# Altium schematic sheet ESP32_BDB-2.SchDoc
size Tabloid; SheetNumber: 2; SheetTotal: 2
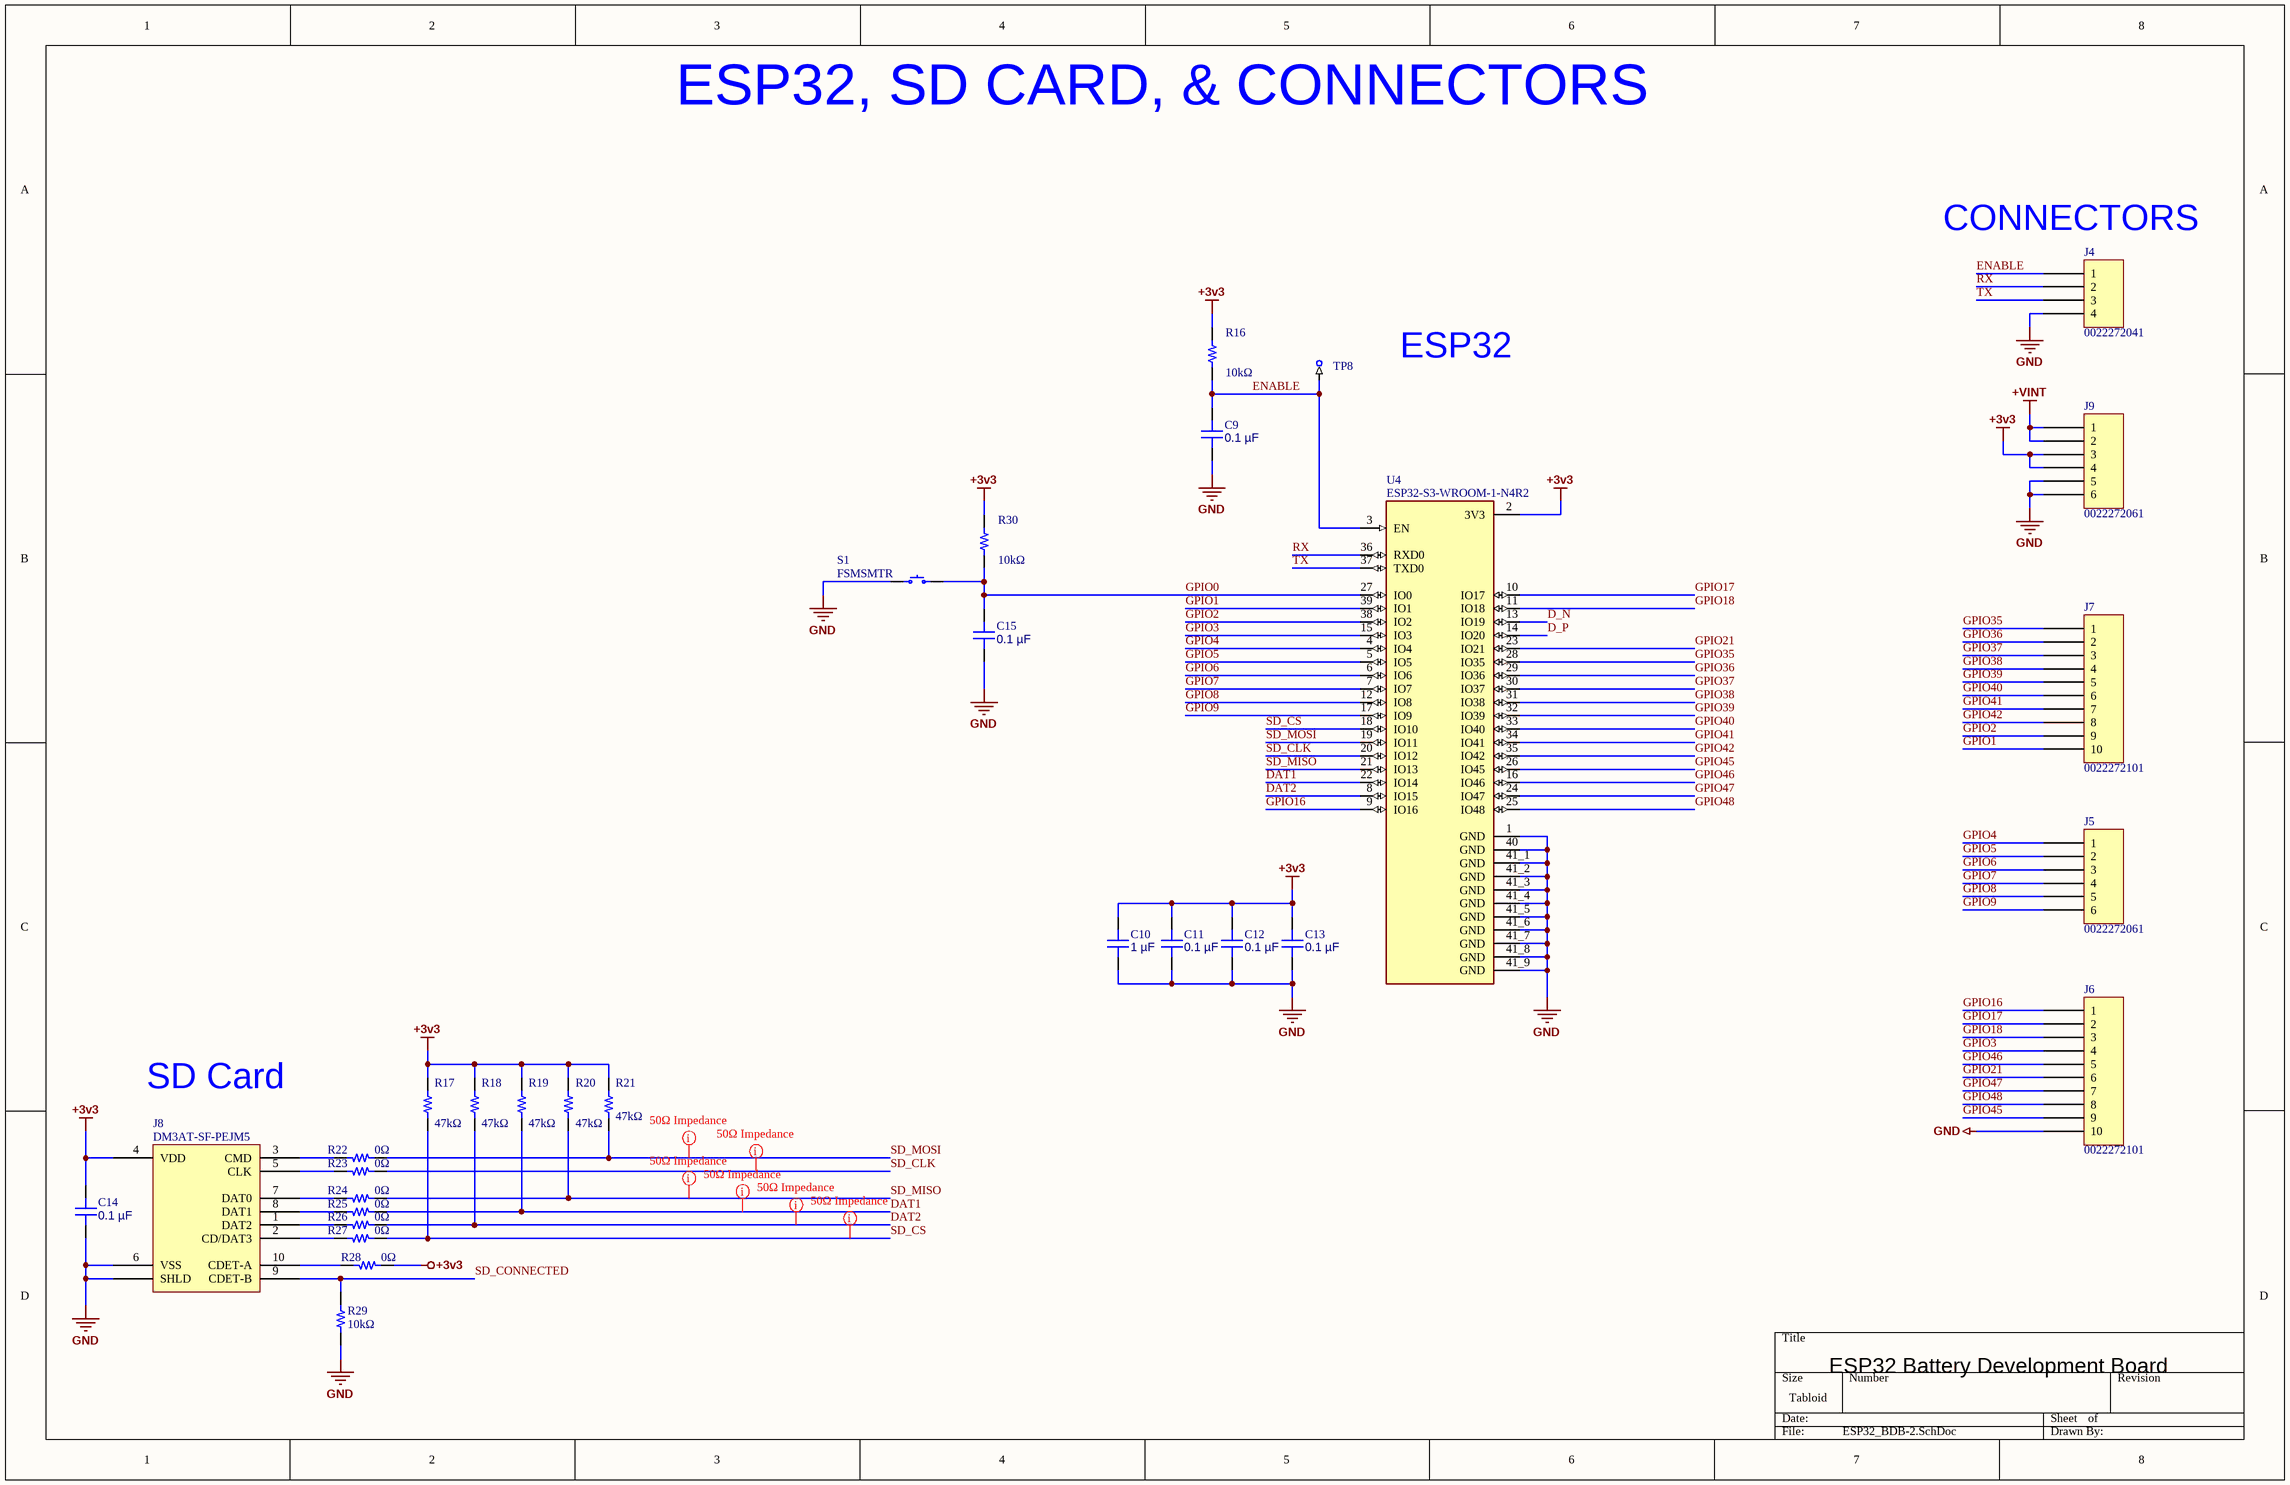
[diagram p0: ESP32_BDB-2.SchDoc]

## Parts
C9  0.1 µF  [CAP 0603_1608]
C10  1 µF  [CAP 0603_1608]
C11  0.1 µF  [CAP 0603_1608]
C12  0.1 µF  [CAP 0603_1608]
C13  0.1 µF  [CAP 0603_1608]
C14  0.1 µF  [CAP 0603_1608]
C15  0.1 µF  [CAP 0603_1608]
J4  0022272041  [MOLEX KK 0022272041]
J5  0022272061  [MOLEX KK 0022272061]
J6  0022272101  [MOLEX KK 0022272101]
J7  0022272101  [MOLEX KK 0022272101]
J8  DM3AT-SF-PEJM5  [HIROSE DM3AT-SF-PEJM5]
J9  0022272061  [MOLEX KK 0022272061]
R16  10kΩ  [RES 0603_1608]
R17  47kΩ  [RES 0603_1608]
R18  47kΩ  [RES 0603_1608]
R19  47kΩ  [RES 0603_1608]
R20  47kΩ  [RES 0603_1608]
R21  47kΩ  [RES 0603_1608]
R22  0Ω  [RES 0805_2012]
R23  0Ω  [RES 0805_2012]
R24  0Ω  [RES 0805_2012]
R25  0Ω  [RES 0805_2012]
R26  0Ω  [RES 0805_2012]
R27  0Ω  [RES 0805_2012]
R28  0Ω  [RES 0805_2012]
R29  10kΩ  [RES 0603_1608]
R30  10kΩ  [RES 0603_1608]
S1  FSMSMTR  [TE FSMSMTR]
TP8  5016  [KEYSTONE-5016_V]  (value not drawn)
U4  ESP32-S3-WROOM-1-N4R2  [XCVR_ESP32-S3-WROOM-1-N4R2]

## Nets
+3v3: C10.2 C11.2 C12.2 C13.2 C14.2 J8.4(VDD) J9.3 J9.4 R16.2 R17.2 R18.2 R19.2 R20.2 R21.2 R28.1 R30.2 U4.2(3V3)
+VINT: J9.1 J9.2
GND: C9.1 C10.1 C11.1 C12.1 C13.1 C14.1 C15.1 J4.4 J6.10 J8.6(VSS) J8.S(SHLD) J9.5 J9.6 R29.1 S1.1 U4.1(GND) U4.40(GND) U4.41_1(GND) U4.41_2(GND) U4.41_3(GND) U4.41_4(GND) U4.41_5(GND) U4.41_6(GND) U4.41_7(GND) U4.41_8(GND) U4.41_9(GND)
D_N: U4.13(IO19)
D_P: U4.14(IO20)
DAT1: R19.1 R25.1 U4.22(IO14)
DAT2: R18.1 R26.1 U4.8(IO15)
ENABLE: C9.2 J4.1 R16.1 TP8.1 U4.3(EN)
GPIO0: C15.2 R30.1 S1.2 U4.27(IO0)
GPIO1: J7.10 U4.39(IO1)
GPIO2: J7.9 U4.38(IO2)
GPIO3: J6.4 U4.15(IO3)
GPIO4: J5.1 U4.4(IO4)
GPIO5: J5.2 U4.5(IO5)
GPIO6: J5.3 U4.6(IO6)
GPIO7: J5.4 U4.7(IO7)
GPIO8: J5.5 U4.12(IO8)
GPIO9: J5.6 U4.17(IO9)
GPIO16: J6.1 U4.9(IO16)
GPIO17: J6.2 U4.10(IO17)
GPIO18: J6.3 U4.11(IO18)
GPIO21: J6.6 U4.23(IO21)
GPIO35: J7.1 U4.28(IO35)
GPIO36: J7.2 U4.29(IO36)
GPIO37: J7.3 U4.30(IO37)
GPIO38: J7.4 U4.31(IO38)
GPIO39: J7.5 U4.32(IO39)
GPIO40: J7.6 U4.33(IO40)
GPIO41: J7.7 U4.34(IO41)
GPIO42: J7.8 U4.35(IO42)
GPIO45: J6.9 U4.26(IO45)
GPIO46: J6.5 U4.16(IO46)
GPIO47: J6.7 U4.24(IO47)
GPIO48: J6.8 U4.25(IO48)
RX: J4.2 U4.36(RXD0)
SD_CLK: R23.1 U4.20(IO12)
SD_CONNECTED: J8.9(CDET-B) R29.2
SD_CS: R17.1 R27.1 U4.18(IO10)
SD_MISO: R20.1 R24.1 U4.21(IO13)
SD_MOSI: R21.1 R22.1 U4.19(IO11)
TX: J4.3 U4.37(TXD0)
NetJ8_1: J8.1(DAT2) R26.2
NetJ8_2: J8.2(CD/DAT3) R27.2
NetJ8_3: J8.3(CMD) R22.2
NetJ8_5: J8.5(CLK) R23.2
NetJ8_7: J8.7(DAT0) R24.2
NetJ8_8: J8.8(DAT1) R25.2
NetJ8_10: J8.10(CDET-A) R28.2

## Layout directives
rule Width Constraint [Pref Impedance = 50.00ohms    Min Impedance = 50.00ohms    Max Impedance = 50.00ohms]: DAT1, DAT2, SD_CLK, SD_CS, SD_MISO, SD_MOSI

## Notes on the sheet
- ESP32, SD CARD, & CONNECTORS
- (near J4) CONNECTORS
- ESP32
- SD Card
- ESP32 Battery Development Board

## Library data of the parts
C9 C11-C15 = C0603C104K5RAC7411: CAP CER 0.1UF 50V X7R 0603; manufacturer: KEMET; Tolerance: ±10%; Part Number: C0603C104K5RAC7411; Capacitance: 0.1 µF; Applications: Bypass, Decoupling; componentlink1description: Datasheet; componentlink1url: https://api.kemet.com/component-edge/download/datasheet/C0603C104K5RAC7411.pdf; componentlink2description: DigiKey Link; componentlink2url: https://www.digikey.com/en/products/detail/kemet/C0603C104K5RAC7411/3317013; Device Package: 0603 (1608 Metric); lastupdated: 2026-04-06 7:23:52 PM; Lifecycle Status: Active; Minimum Order: 1; Mounting Type: Surface Mount, MLCC; Operating Temperature: -55°C ~ 125°C; Package / Case: 0603 (1608 Metric); packaging: TapeAndReel; partid: 2233; Part Status: Active; price: 0.01; series: SMD Comm X7R; Size / Dimension: 0.063" L x 0.031" W (1.60mm x 0.80mm); Supplier 1: DigiKey; Supplier Part Number 1: 399-C0603C104K5RAC7411CT-ND; Temperature Coefficient: X7R; Thickness (Max): 0.035" (0.90mm); value: 0.1 µF; Voltage - Rated: 50V
C10 = CC0603KRX7R6BB105: CAP CER 1UF 10V X7R 0603; manufacturer: Yageo; Tolerance: ±10%; Part Number: CC0603KRX7R6BB105; Capacitance: 1 µF; Applications: General Purpose; componentlink1description: Datasheet; componentlink1url: https://www.yageo.com/upload/media/product/productsearch/datasheet/mlcc/UPY-GPHC_X7R_6.3V-to-50V_18.pdf; componentlink2description: DigiKey Link; componentlink2url: https://www.digikey.com/en/products/detail/yageo/CC0603KRX7R6BB105/5195204; Device Package: 0603 (1608 Metric); lastupdated: 2026-04-06 7:23:52 PM; Lifecycle Status: Active; Minimum Order: 1; Mounting Type: Surface Mount, MLCC; Operating Temperature: -55°C ~ 125°C; Package / Case: 0603 (1608 Metric); packaging: TapeAndReel; partid: 2290; Part Status: Active; price: 0.02; series: CC; Size / Dimension: 0.063" L x 0.031" W (1.60mm x 0.80mm); Supplier 1: DigiKey; Supplier Part Number 1: 311-1796-1-ND; Temperature Coefficient: X7R; Thickness (Max): 0.035" (0.90mm); value: 1 µF; Voltage - Rated: 10V
J4 = 0022272041: CONN HEADER VERT 4POS 2.54MM; Manufacturer: Molex; Contact Length - Mating: 0.295" (7.49mm); Contact Length - Post: 0.140" (3.56mm); Material Flammability Rating: UL94 V-0; Number of Positions: 4; Number of Positions Loaded: All; Overall Contact Length: 0.560" (14.22mm); Pitch - Mating: 0.100" (2.54mm); Shrouding: Shrouded - 1 Wall; Style: Board to Cable/Wire; Part Number: 0022272041; ComponentLink1Description: Datasheet; ComponentLink1URL: https://www.molex.com/pdm_docs/sd/022272041_sd.pdf; ComponentLink2Description: DigiKey Link; ComponentLink2URL: http://digikey.com/product-detail/en/molex/0022272041/WM4113-ND/1130579; Connector Type: Header; Contact Finish - Mating: Tin; Contact Finish - Post: Tin; Contact Finish Thickness - Mating: 100.0µin (2.54µm); Contact Material: Brass; Contact Shape: Square; Contact Type: Male Pin; Fastening Type: Friction Lock; Insulation Color: Natural; Insulation Height: 0.461" (11.70mm); Insulation Material: Polyamide (PA), Nylon; LastUpdated: 2020-01-12 11:52:05 PM; Lifecycle Status: Active; Minimum Order: 1; Mounting Type: Through Hole; Number of Rows: 1; Packaging: Bulk; PartId: 78; Part Status: Active; Price: 0.40; Series: KK 6410; Supplier 1: DigiKey; Supplier Part Number 1: WM4113-ND; Termination: Solder
J5 J9 = 0022272061: CONN HEADER VERT 6POS 2.54MM; Manufacturer: Molex; Contact Length - Mating: 0.295" (7.49mm); Contact Length - Post: 0.140" (3.56mm); Material Flammability Rating: UL94 V-0; Number of Positions: 6; Number of Positions Loaded: All; Overall Contact Length: 0.560" (14.22mm); Pitch - Mating: 0.100" (2.54mm); Shrouding: Shrouded - 1 Wall; Style: Board to Cable/Wire; Part Number: 0022272061; ComponentLink1Description: Datasheet; ComponentLink1URL: https://www.molex.com/pdm_docs/sd/022272061_sd.pdf; ComponentLink2Description: DigiKey Link; ComponentLink2URL: http://digikey.com/product-detail/en/molex/0022272061/WM4115-ND/1130581; Connector Type: Header; Contact Finish - Mating: Tin; Contact Finish - Post: Tin; Contact Finish Thickness - Mating: 100.0µin (2.54µm); Contact Material: Brass; Contact Shape: Square; Contact Type: Male Pin; Fastening Type: Friction Lock; Insulation Color: Natural; Insulation Height: 0.461" (11.70mm); Insulation Material: Polyamide (PA), Nylon; LastUpdated: 2020-01-12 11:52:24 PM; Lifecycle Status: Active; Minimum Order: 1; Mounting Type: Through Hole; Number of Rows: 1; Packaging: Bulk; PartId: 80; Part Status: Active; Price: 0.49; Series: KK 6410; Supplier 1: DigiKey; Supplier Part Number 1: WM4115-ND; Termination: Solder
J6 J7 = 0022272101: CONN HEADER VERT 10POS 2.54MM; Manufacturer: Molex; Contact Length - Mating: 0.295" (7.49mm); Contact Length - Post: 0.140" (3.56mm); Material Flammability Rating: UL94 V-0; Number of Positions: 10; Number of Positions Loaded: All; Overall Contact Length: 0.560" (14.22mm); Pitch - Mating: 0.100" (2.54mm); Shrouding: Shrouded - 1 Wall; Style: Board to Cable/Wire; Part Number: 0022272101; ComponentLink1Description: Datasheet; ComponentLink1URL: https://www.molex.com/pdm_docs/sd/022272101_sd.pdf; ComponentLink2Description: DigiKey Link; ComponentLink2URL: http://digikey.com/product-detail/en/molex/0022272101/WM4119-ND/1130585; Connector Type: Header; Contact Finish - Mating: Tin; Contact Finish - Post: Tin; Contact Finish Thickness - Mating: 100.0µin (2.54µm); Contact Material: Brass; Contact Shape: Square; Contact Type: Male Pin; Fastening Type: Friction Lock; Insulation Color: Natural; Insulation Height: 0.461" (11.70mm); Insulation Material: Polyamide (PA), Nylon; LastUpdated: 2020-01-12 11:53:02 PM; Lifecycle Status: Active; Minimum Order: 1; Mounting Type: Through Hole; Number of Rows: 1; Packaging: Bulk; PartId: 84; Part Status: Active; Price: 0.73; Series: KK 6410; Supplier 1: DigiKey; Supplier Part Number 1: WM4119-ND; Termination: Solder
J8 = DM3AT-SF-PEJM5: CONN MICRO SD CARD PUSH-PUSH R/A; Manufacturer: Hirose Electric Co Ltd; Card Type: Secure Digital - microSD™; Connector Type: Connector and Ejector; Insertion, Removal Method: Push In, Push Out; Number of Positions: 10 (8 + 2); Part Number: DM3AT-SF-PEJM5; ComponentLink1Description: Datasheet; ComponentLink1URL: https://www.hirose.com/product/document?clcode=CL0609-0033-6-00&productname=DM3AT-SF-PEJ2M5&series=DM3&documenttype=Catalog&lang=en&documentid=D49662_en; ComponentLink2Description: DigiKey Link; ComponentLink2URL: //digikey.com/product-detail/en/hirose-electric-co-ltd/DM3AT-SF-PEJM5/HR1964TR-ND/2533565; Contact Finish: Gold; Features: Switch; Height Above Board: 0.066" (1.68mm); LastUpdated: 2019-12-16 8:34:40 PM; Lifecycle Status: 0; Minimum Order: 1; Mounting Feature: Normal, Standard - Top; Mounting Type: Surface Mount, Right Angle; Packaging: TapeAndReel; Part Status: Active; Price: 1.41; Series: DM3; Supplier 1: DigiKey; Supplier Part Number 1: HR1964TR-ND
R16 R29 R30 = AA0603FR-0710KL: RES SMD 10K OHM 1% 1/10W 0603; Manufacturer: Yageo; Value: 10 kOhms; Power (Watts): 0.1W, 1/10W; Temperature Coefficient: ±150ppm/°C; Part Number: AA0603FR-0710KL; ComponentLink1Description: Datasheet; ComponentLink1URL: https://www.yageo.com/upload/media/product/productsearch/datasheet/rchip/PYu-AA_51_RoHS_L_3.pdf; ComponentLink2Description: DigiKey Link; ComponentLink2URL: https://www.digikey.com/en/products/detail/yageo/AA0603FR-0710KL/5888698; Composition: Thick Film; Device Package: 0603 (1608 Metric); Features: Anti-Sulfur, Automotive AEC-Q200, Moisture Resistant; Height - Seated (Max): 0.022" (0.55mm); LastUpdated: 2026-04-06 7:43:37 PM; Lifecycle Status: Active; Minimum Order: 1; Number of Terminations: 2; Operating Temperature: -55°C ~ 155°C; Package / Case: 0603 (1608 Metric); Packaging: TapeAndReel; PartId: 64302; Part Status: Active; Price: 0.01; Ratings: AEC-Q200; Resistance: 10 kOhms; Series: AA; Size / Dimension: 0.063" L x 0.031" W (1.60mm x 0.80mm); Supplier 1: DigiKey; Supplier Part Number 1: 13-AA0603FR-0710KLCT-ND; Supplier Device Package: 0603; Tolerance: ±1%
R17-R21 = AC0603FR-0747KL: RES SMD 47K OHM 1% 1/10W 0603; Manufacturer: Yageo; Value: 47 kOhms; Power (Watts): 0.1W, 1/10W; Temperature Coefficient: ±100ppm/°C; Part Number: AC0603FR-0747KL; ComponentLink1Description: Datasheet; ComponentLink1URL: https://www.yageo.com/upload/media/product/productsearch/datasheet/rchip/PYu-AC_51_RoHS_L_7.pdf; ComponentLink2Description: DigiKey Link; ComponentLink2URL: https://www.digikey.com/en/products/detail/yageo/AC0603FR-0747KL/5896142; Composition: Thick Film; Device Package: 0603 (1608 Metric); Features: Automotive AEC-Q200, Moisture Resistant; Height - Seated (Max): 0.022" (0.55mm); LastUpdated: 2026-04-06 7:43:48 PM; Lifecycle Status: Active; Minimum Order: 1; Number of Terminations: 2; Operating Temperature: -55°C ~ 155°C; Package / Case: 0603 (1608 Metric); Packaging: CutTape; PartId: 17391; Part Status: Active; Price: 0.01; Ratings: AEC-Q200; Resistance: 47 kOhms; Series: AC; Size / Dimension: 0.063" L x 0.031" W (1.60mm x 0.80mm); Supplier 1: DigiKey; Supplier Part Number 1: YAG3610CT-ND; Supplier Device Package: 0603; Tolerance: ±1%
R22-R28 = TLRZ2ATTD: RES 0 OHM JUMPER 0805; Manufacturer: KOA Speer Electronics, Inc.; Value: 0 Ohms; Part Number: TLRZ2ATTD; ComponentLink1Description: Datasheet; ComponentLink1URL: http://www.koaspeer.com/catimages/Products/TLRZ/TLRZ.pdf; ComponentLink2Description: DigiKey Link; ComponentLink2URL: https://www.digikey.com/en/products/detail/koa-speer-electronics-inc/TLRZ2ATTD/9845494; Composition: Metal Element; Device Package: 0805 (2012 Metric); Features: Automotive AEC-Q200, Current Sense; Height - Seated (Max): 0.022" (0.55mm); LastUpdated: 2026-04-05 8:11:26 PM; Lifecycle Status: Active; Minimum Order: 1; Number of Terminations: 2; Operating Temperature: -65°C ~ 170°C; Package / Case: 0805 (2012 Metric); Packaging: TapeAndReel; PartId: 27685; Part Status: Active; Price: 0.08; Ratings: AEC-Q200; Resistance: 0 Ohms; Series: TLRZ; Size / Dimension: 0.079" L x 0.049" W (2.00mm x 1.25mm); Supplier 1: DigiKey; Supplier Part Number 1: 2019-TLRZ2ATTDCT-ND; Supplier Device Package: 0805; Tolerance: Jumper
S1 = FSMSMTR: SWITCH TACTILE SPST-NO 0.05A 24V; Manufacturer: TE Connectivity ALCOSWITCH Switches; Actuator Height off PCB, Vertical: 4.57mm; Actuator Orientation: Top Actuated; Actuator Type: Standard; Contact Rating @ Voltage: 0.05A @ 24VDC; Illumination: Non-Illuminated; Operating Force: 180gf; Outline: 6.00mm x 3.50mm; Switch Function: Off-Mom; Part Number: FSMSMTR; Circuit: SPST-NO; ComponentLink1Description: Datasheet; ComponentLink1URL: https://www.te.com/commerce/DocumentDelivery/DDEController?Action=srchrtrv&DocNm=1437566-3&DocType=Customer+Drawing&DocLang=English; ComponentLink2Description: DigiKey Link; ComponentLink2URL: https://www.digikey.com/en/products/detail/te-connectivity-alcoswitch-switches/FSMSMTR/529671; LastUpdated: 2026-04-05 8:58:52 PM; Lifecycle Status: Active; Minimum Order: 1; Mounting Type: Surface Mount; Operating Temperature: -35°C ~ 85°C; Packaging: TapeAndReel; Part Status: Active; Price: 0.20; Series: FSMSM; Supplier 1: DigiKey; Supplier Part Number 1: 450-1758-1-ND; Termination Style: Gull Wing
TP8 = CMP-2000-05178-1: Test Point, 1-Pin SMT, RoHS, Tape and Reel; Manufacturer: Keystone; Other Names: 5016KDKR; Featured Product: SurfaceMountTestPoints / 5019MiniatureSurfaceMountTestPoint; Online Catalog: SurfaceMountTestPoints; Catalog Drawings: 5016Top / 5016Side / 5016Front; Packaging: Digi-Reel; RoHS Information: RoHSComplianceStatement; Package Reference: 5016; Mounting Type: SurfaceMount; Type: PCTestPoint,Compact; Manufacturer URL: http://www.keyelco.com/; Standard Package: 1; Package Description: 1-Pin Test Point, Body 3.81 x 2.04 mm; Category: TestandMeasurement; Terminal: 0.015"(0.38mm)PhosphorBronze,SilverPlated; Datasheet URL: https://ciiva.com/datasheet-click-2917613?src=ciiva&sig=4a4e90f; Datasheet Version: Rev. D, 03/2014; Family: TestPoints; Material: PhosphorBronze
U4 = ESP32-S3-WROOM-1-N4R2: Bluetooth, WiFi 802.11b/g/n, Bluetooth v5.0 Transceiver Module 2.4GHz PCB Trace Surface Mount; MF: Espressif Systems; Package: None; Purchase-URL: https://pricing.snapeda.com/search/part/ESP32-S3-WROOM-1-N4R2/?ref=eda; Price: None; Availability: In Stock; Check_prices: https://www.snapeda.com/parts/ESP32-S3-WROOM-1-N4R2/Espressif+Systems/view-part/?ref=eda; MP: ESP32-S3-WROOM-1-N4R2; SnapEDA_Link: https://www.snapeda.com/parts/ESP32-S3-WROOM-1-N4R2/Espressif+Systems/view-part/?ref=snap; Value: *